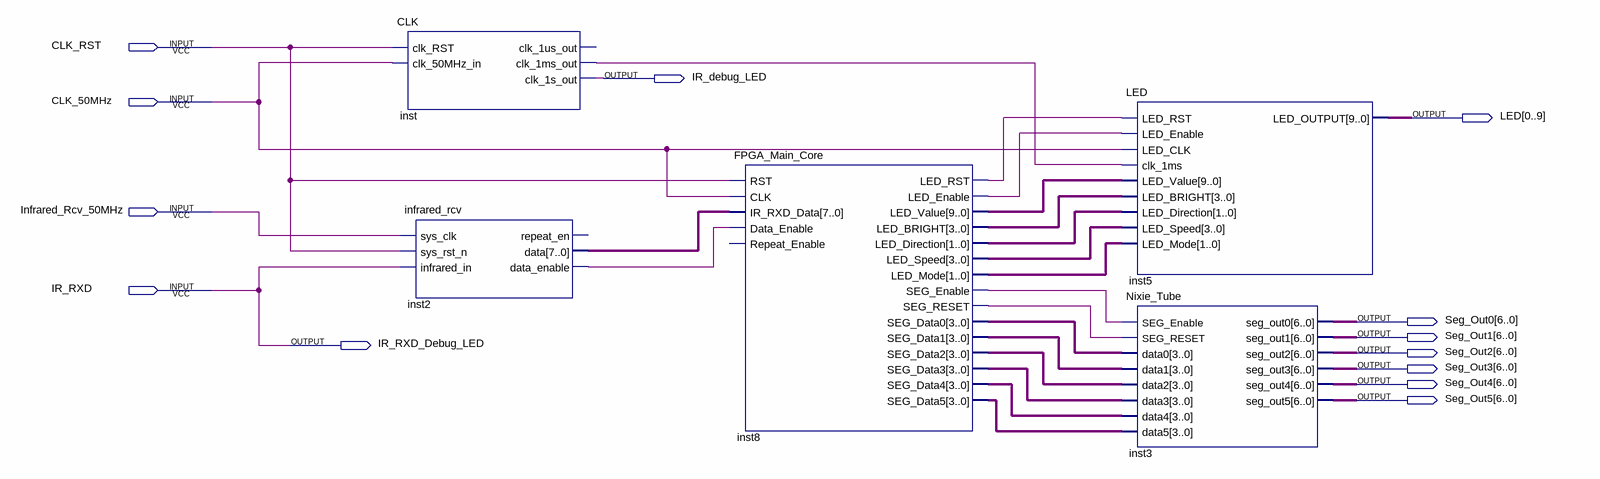
[diagram p0: schematic sheet]
// Quartus schematic Infrared_control.bdf as structural Verilog: 5 symbols, 13 pins
module Infrared_control (
  input  CLK_RST,
  input  CLK_50MHz,
  input  Infrared_Rcv_50MHz,
  input  IR_RXD,
  output IR_debug_LED,
  output [0:9] LED,
  output [6:0] Seg_Out0,
  output [6:0] Seg_Out1,
  output IR_RXD_Debug_LED,
  output [6:0] Seg_Out2,
  output [6:0] Seg_Out3,
  output [6:0] Seg_Out4,
  output [6:0] Seg_Out5
);

  wire inst2_data_enable, inst8_led_enable, inst8_led_rst, inst8_seg_enable, inst8_seg_reset,
       inst_clk_1ms_out;
  wire [1:0] inst8_led_direction, inst8_led_mode;
  wire [3:0] inst8_led_bright, inst8_led_speed, inst8_seg_data0, inst8_seg_data1, inst8_seg_data2,
       inst8_seg_data3, inst8_seg_data4, inst8_seg_data5;
  wire [7:0] inst2_data;
  wire [9:0] inst8_led_value;

  CLK inst (
    .clk_RST(CLK_RST), .clk_50MHz_in(CLK_50MHz), .clk_1ms_out(inst_clk_1ms_out), .clk_1s_out(IR_debug_LED));  // open: clk_1us_out
  infrared_rcv inst2 (
    .sys_clk(Infrared_Rcv_50MHz), .sys_rst_n(CLK_RST), .infrared_in(IR_RXD), .data(inst2_data),
    .data_enable(inst2_data_enable));  // open: repeat_en
  FPGA_Main_Core inst8 (
    .RST(CLK_RST), .CLK(CLK_50MHz), .IR_RXD_Data(inst2_data), .Data_Enable(inst2_data_enable),
    .LED_RST(inst8_led_rst), .LED_Enable(inst8_led_enable), .LED_Value(inst8_led_value),
    .LED_BRIGHT(inst8_led_bright), .LED_Direction(inst8_led_direction), .LED_Speed(inst8_led_speed),
    .LED_Mode(inst8_led_mode), .SEG_Enable(inst8_seg_enable), .SEG_RESET(inst8_seg_reset),
    .SEG_Data0(inst8_seg_data0), .SEG_Data1(inst8_seg_data1), .SEG_Data2(inst8_seg_data2),
    .SEG_Data3(inst8_seg_data3), .SEG_Data4(inst8_seg_data4), .SEG_Data5(inst8_seg_data5));  // open: Repeat_Enable
  LED inst5 (
    .LED_RST(inst8_led_rst), .LED_Enable(inst8_led_enable), .LED_CLK(CLK_50MHz), .clk_1ms(inst_clk_1ms_out),
    .LED_Value(inst8_led_value), .LED_BRIGHT(inst8_led_bright), .LED_Direction(inst8_led_direction),
    .LED_Speed(inst8_led_speed), .LED_Mode(inst8_led_mode), .LED_OUTPUT(LED));
  Nixie_Tube inst3 (
    .SEG_Enable(inst8_seg_enable), .SEG_RESET(inst8_seg_reset), .data0(inst8_seg_data0),
    .data1(inst8_seg_data1), .data2(inst8_seg_data2), .data3(inst8_seg_data3), .data4(inst8_seg_data4),
    .data5(inst8_seg_data5), .seg_out0(Seg_Out0), .seg_out1(Seg_Out1), .seg_out2(Seg_Out2),
    .seg_out3(Seg_Out3), .seg_out4(Seg_Out4), .seg_out5(Seg_Out5));

  assign IR_RXD_Debug_LED = IR_RXD;
endmodule
